# EAGLE design usb (EAGLE 5.11)
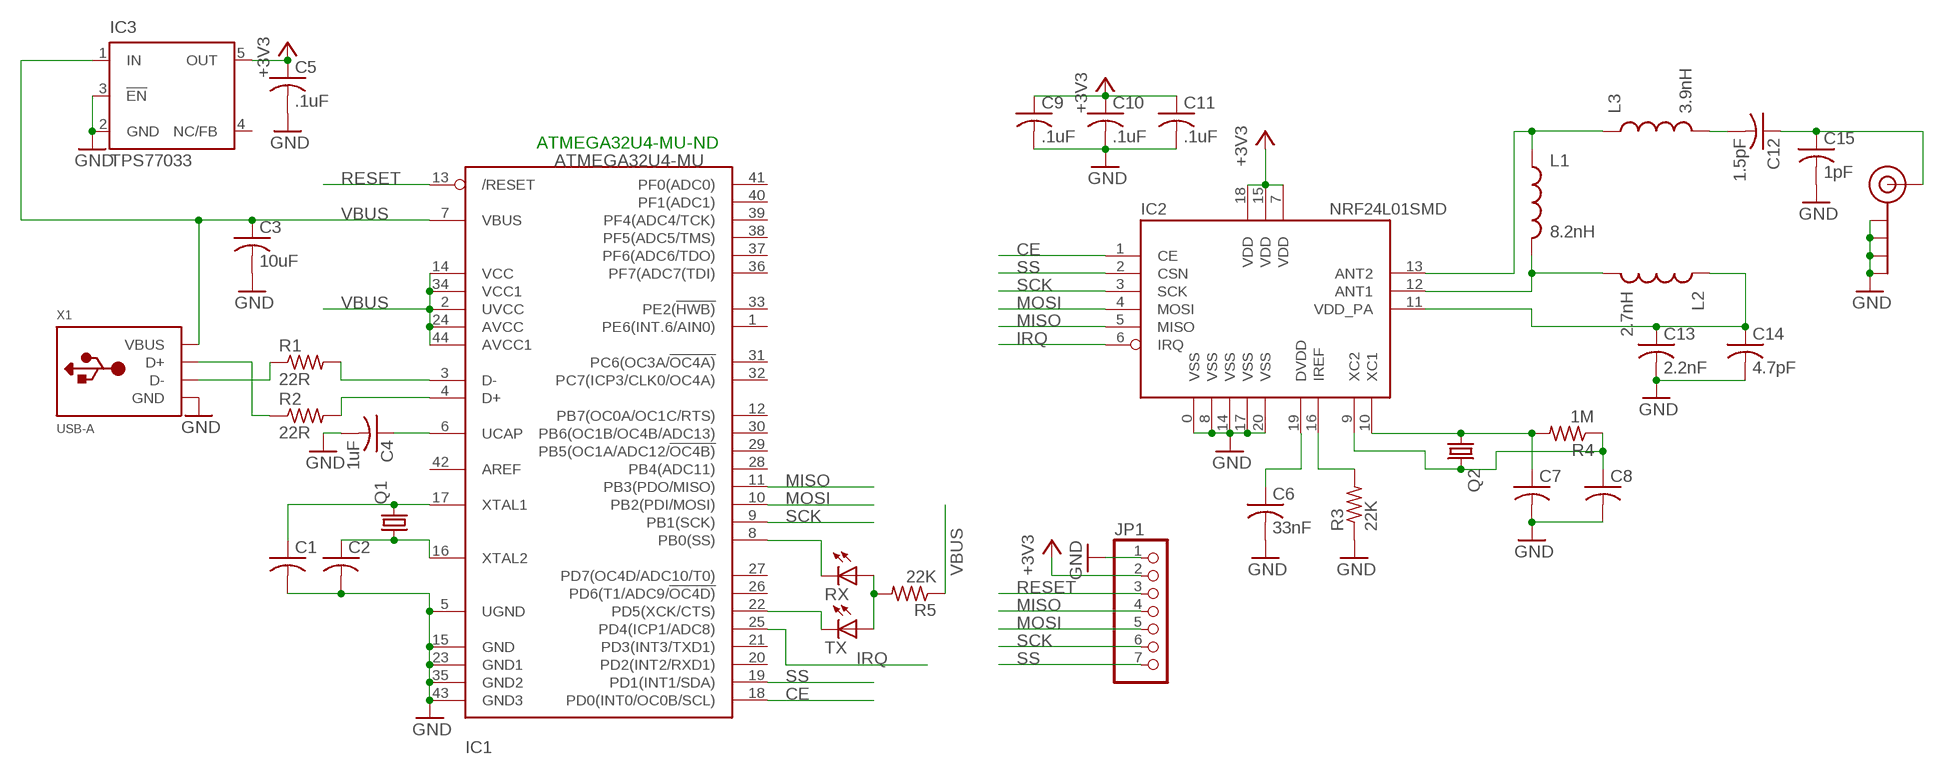
[diagram p0: schematic, sheet 1]

## Parts
C1  C-USC0603  [C0603]
C2  C-USC0603  [C0603]
C3  10uF  C-USC0805K  [C0805K]
C4  1uF  C-USC0603  [C0603]
C5  .1uF  C-USC0603  [C0603]
C6  33nF  C-USC0603  [C0603]
C7  C-USC0603  [C0603]
C8  C-USC0603  [C0603]
C9  .1uF  C-USC0603  [C0603]
C10  .1uF  C-USC0603  [C0603]
C11  .1uF  C-USC0603  [C0603]
C12  1.5pF  C-USC0603  [C0603]
C13  2.2nF  C-USC0603  [C0603]
C14  4.7pF  C-USC0603  [C0603]
C15  1pF  C-USC0603  [C0603]
IC1  ATMEGA32U4-MU  [QFN44]
IC2  NRF24L01SMD  [QFN20]
IC3  TPS77033  [SOT23-DBV]
J$1  SMA_EDGE  [SMA-EDGE]
JP1  PINHD-1X7  [1X07]
L1  8.2nH  INDUCTOR0402  [C0402]
L2  2.7nH  INDUCTOR0402  [C0402]
L3  3.9nH  INDUCTOR0402  [C0402]
Q1  CRYSTALHC49U-V  [HC49U-V]
Q2  CRYSTALHC49U-V  [HC49U-V]
R1  22R  R-US_R0603  [R0603]
R2  22R  R-US_R0603  [R0603]
R3  22K  R-US_R0603  [R0603]
R4  1M  R-US_R0603  [R0603]
R5  22K  R-US_R0603  [R0603]
RX  LEDCHIPLED_0805  [CHIPLED_0805]
TX  LEDCHIPLED_0805  [CHIPLED_0805]
X1  USB-A  [MOLEX_480371000]

## Nets
+3V3: C5.1 C9.1 C10.1 C11.1 IC2.7(VDD) IC2.15(VDD) IC2.18(VDD) IC3.5(OUT) JP1.2
CE: IC1.18(PD0(INT0/OC0B/SCL)) IC2.1(CE)
GND: C1.2 C2.2 C3.2 C4.2 C5.2 C6.2 C7.2 C8.2 C9.2 C10.2 C11.2 C13.2 C14.2 C15.2 IC1.5(UGND) IC1.15(GND) IC1.23(GND1) IC1.35(GND2) IC1.43(GND3) IC2.0(VSS) IC2.8(VSS) IC2.14(VSS) IC2.17(VSS) IC2.20(VSS) IC3.2(GND) IC3.3(!EN) J$1.GND@0(GND) J$1.GND@1(GND) J$1.GND@2(GND) J$1.GND@3(GND) JP1.1 R3.1 X1.4(GND)
IRQ: IC1.25(PD4(ICP1/ADC8)) IC2.6(IRQ)
MISO: IC1.11(PB3(PDO/MISO)) IC2.5(MISO) JP1.4
MOSI: IC1.10(PB2(PDI/MOSI)) IC2.4(MOSI) JP1.5
N$1: IC1.3(D-) R1.2
N$2: IC1.4(D+) R2.2
N$3: R1.1 X1.2(D-)
N$4: R2.1 X1.3(D+)
N$5: C1.1 IC1.17(XTAL1) Q1.2
N$6: C2.1 IC1.16(XTAL2) Q1.1
N$7: C4.1 IC1.6(UCAP)
N$8: IC1.8(PB0(SS)) RX.C
N$9: IC1.22(PD5(XCK/CTS)) TX.C
N$10: C6.1 IC2.19(DVDD)
N$11: IC2.16(IREF) R3.2
N$12: C7.1 IC2.10(XC1) Q2.1 R4.2
N$13: C8.1 IC2.9(XC2) Q2.2 R4.1
N$14: IC2.13(ANT2) L1.1 L3.1
N$15: IC2.12(ANT1) L1.2 L2.2
N$16: C12.2 L3.2
N$17: C12.1 C15.1 J$1.SIG(SIGNAL)
N$18: C13.1 C14.1 IC2.11(VDD_PA) L2.1
N$19: R5.2 RX.A TX.A
RESET: IC1.13(/RESET) JP1.3
SCK: IC1.9(PB1(SCK)) IC2.3(SCK) JP1.6
SS: IC1.19(PD1(INT1/SDA)) IC2.2(CSN) JP1.7
VBUS: C3.1 IC1.2(UVCC) IC1.7(VBUS) IC1.14(VCC) IC1.24(AVCC) IC1.34(VCC1) IC1.44(AVCC1) IC3.1(IN) R5.1 X1.1(VBUS)
Unconnected: IC1.1(PE6(INT.6/AIN0)) IC1.12(PB7(OC0A/OC1C/RTS)) IC1.20(PD2(INT2/RXD1)) IC1.21(PD3(INT3/TXD1)) IC1.26(PD6(T1/ADC9/!OC4D)) IC1.27(PD7(OC4D/ADC10/T0)) IC1.28(PB4(ADC11)) IC1.29(PB5(OC1A/ADC12/!OC4B)) IC1.30(PB6(OC1B/OC4B/ADC13)) IC1.31(PC6(OC3A/!OC4A)) IC1.32(PC7(ICP3/CLK0/OC4A)) IC1.33(PE2(!HWB)) IC1.36(PF7(ADC7(TDI)) IC1.37(PF6(ADC6/TDO)) IC1.38(PF5(ADC5/TMS)) IC1.39(PF4(ADC4/TCK)) IC1.40(PF1(ADC1)) IC1.41(PF0(ADC0)) IC1.42(AREF) IC3.4(NC/FB)

## Notes on the sheet
- ATMEGA32U4-MU-ND

## Library data of the parts
C1-C15 = adafruit:C-US: CAPACITOR, American symbol
IC1 = adafruit:ATMEGA32U4: http://www.ladyada.net/library/eagle
IC2 = SparkFun:NRF24L01: 2.4GHz Low Power Transceiver This is the very popular, low cost, very low power RF transceiver from Nordic Semiconductor. Simple SPI interface. SKU: COM-00690
IC3 = texas:TPS770*: ULTRALOW-POWER 50-mA LOW-DROPOUT LINEAR REGULATORS 50-mA Low-Dropout Regulator Source: http://focus.ti.com/lit/ds/symlink/tps77001.pdf; MF: TEXAS INSTRUMENTS; MPN: TPS77033DBVT; OC_FARNELL: 8461570; OC_NEWARK: 77C1187
J$1 = SparkFun:SMA_EDGE: SMA Antenna Connector End launch SMA connector. The paste layer has been removed so that the connector can be hand soldered onto the board after reflow.
JP1 = pinhead:PINHD-1X7: PIN HEADER
L1-L3 = SparkFun:INDUCTOR: Inductors Basic Inductor/Choke - 0603 and 1206. Footprints are not proven and vary greatly between part numbers.
Q1 Q2 = crystal:CRYSTAL: CRYSTAL; OC_FARNELL: 1666969; OC_NEWARK: unknown
R1-R5 = adafruit:R-US_: RESISTOR, American symbol
RX TX = adafruit:LED: LED OSRAM: - CHIPLED LG R971, LG N971, LY N971, LG Q971, LY Q971, LO R971, LY R971 LH N974, LH R974 LS Q976, LO Q976, LY Q976 LO Q996 - Hyper CHIPLED LW Q18S LB Q993, LB Q99A, LB R99A - SideLED LS A670, LO A670, LY A670, LG A670, LP A670 LB A673, LV A673, LT A673, LW A673 LH A674 LY A675 LS A676, LA A676, LO A676, LY A676, LW A676 LS A679, LY A679, LG A679 - Hyper Micro SIDELED® LS Y876, LA Y876, LO Y876, LY Y876 LT Y87S - SmartLED LW L88C, LW L88S LB L89C, LB L89S, LG L890 LS L89K, LO L89K, LY L89K LS L896, LA L896, LO L896, LY L896 - TOPLED LS T670, LO T670, LY T670, LG T670, LP T670 LSG T670, LSP T670, LSY T670, LOP T670, LYG T670 LG T671, LOG T671, LSG T671 LB T673, LV T673, LT T673, LW T673 LH T674 LS T676, LA T676, LO T676, LY T676, LB T676, LH T676, LSB T676, LW T676 LB T67C, LV T67C, LT T67C, LS T67K, LO T67K, LY T67K, LW E67C LS E67B, LA E67B, LO E67B, LY E67B, LB E67C, LV E67C, LT E67C LW T67C LS T679, LY T679, LG T679 LS T770, LO T770, LY T770, LG T770, LP T770 LB T773, LV T773, LT T773, LW T773 LH T774 LS E675, LA E675, LY E675, LS T675 LS T776, LA T776, LO T776, LY T776, LB T776 LHGB T686 LT T68C, LB T68C - Hyper Mini TOPLED® LB M676 - Mini TOPLED Santana® LG M470 LS M47K, LO M47K, LY M47K Source: http://www.osram.convergy.de/
X1 = adafruit:USB-A: USB type A 'plug' Used for things that can directly connect to a USB port, say USB key

## Board
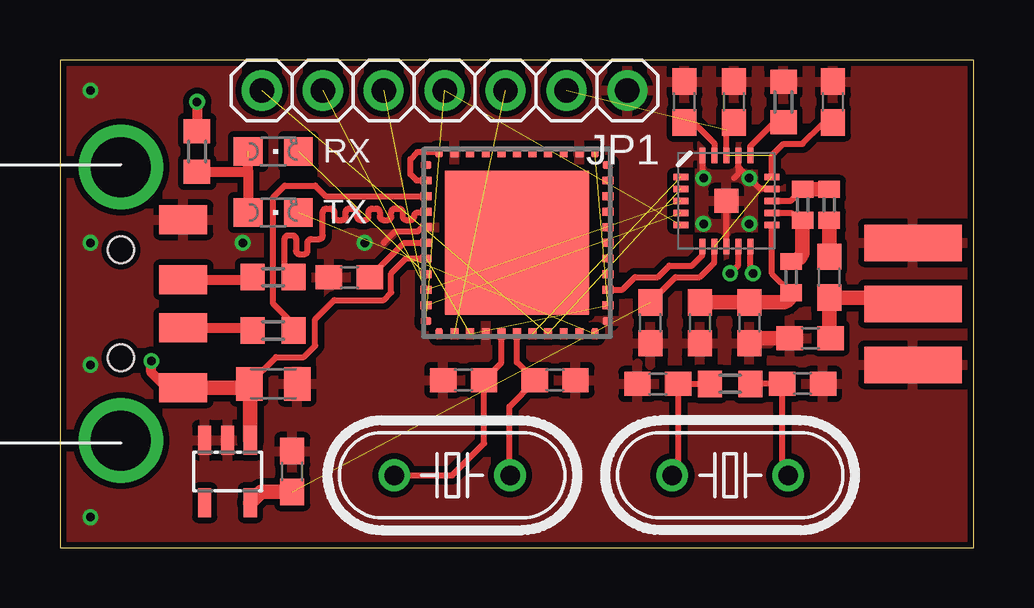
[diagram p1: board, top side]
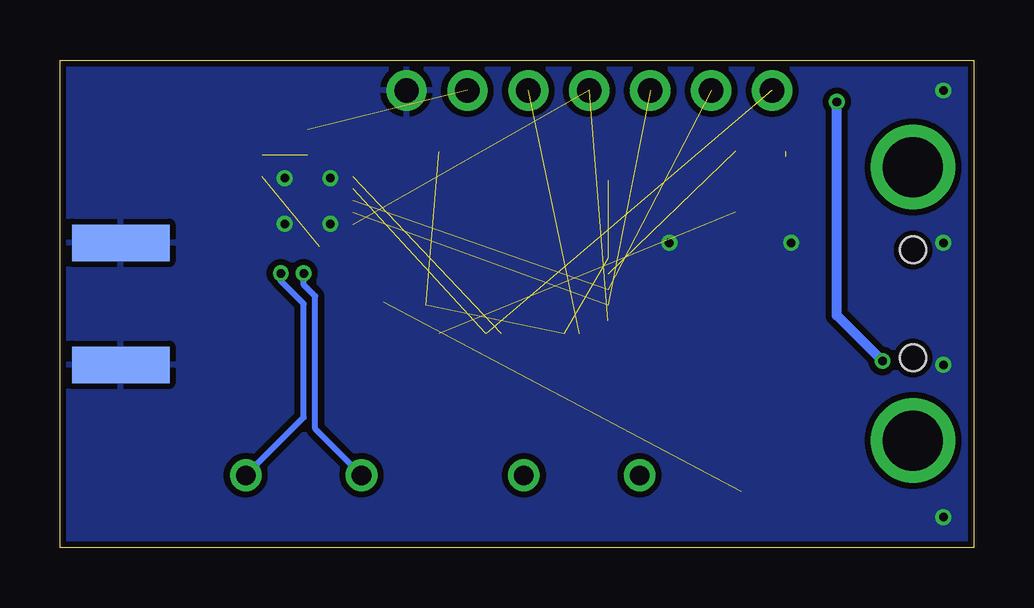
[diagram p2: board, bottom side, seen from below]

Size 38.1 x 20.32 mm. Coordinates in mm from the lower left corner, seen from the top.
Outline: 0,0 38.1,0 38.1,20.32 0,20.32 0,0
Copper layers (1*16): Top 0.035mm / dielectric 1.5mm / Bottom 0.035mm
Design rules "ITead_rule": minimum track width 8mil, minimum drill 12mil, track to track 8mil, track to pad 8mil, pad to pad 8mil, via to via 8mil, smd to smd 8mil, copper to edge 10mil, drill to drill 10mil, minimum pad ring 10mil, minimum via ring 6mil, stop-mask expansion 2mil, vias tented up to drill 100mil, thermal gap 10mil

### Footprints (pad centres in the part's own frame; a part is rotated, then mirrored left to right if it is on the bottom)
C0603 = smd 1.1 x 1: 1 -0.85,0; 2 0.85,0
C0805K = smd 1.1 x 1.4: 1 -1,0; 2 1,0
QFN44 = smd 0.45 x 0.33: 1 -3.788,3.25; 2 -3.788,2.6; 3 -3.788,1.95; 4 -3.788,1.3; 5 -3.788,0.65; 6 -3.788,0; 7 -3.788,-0.65; 8 -3.788,-1.3; 9 -3.788,-1.95; 10 -3.788,-2.6; 11 -3.788,-3.25; 23 3.788,-3.25; 24 3.788,-2.6; 25 3.788,-1.95; 26 3.788,-1.3; 27 3.788,-0.65; 28 3.788,0; 29 3.788,0.65; 30 3.788,1.3; 31 3.788,1.95; 32 3.788,2.6; 33 3.788,3.25 | smd 0.33 x 0.45: 12 -3.25,-3.788; 13 -2.6,-3.788; 14 -1.95,-3.788; 15 -1.3,-3.788; 16 -0.65,-3.788; 17 0,-3.788; 18 0.65,-3.788; 19 1.3,-3.788; 20 1.95,-3.788; 21 2.6,-3.788; 22 3.25,-3.788; 34 3.25,3.788; 35 2.6,3.788; 36 1.95,3.788; 37 1.3,3.788; 38 0.65,3.788; 39 0,3.788; 40 -0.65,3.788; 41 -1.3,3.788; 42 -1.95,3.788; 43 -2.6,3.788; 44 -3.25,3.788 | smd 6 x 6: EXP 0,0
QFN20 = smd 1 x 1: 0 0,0 | smd 0.637 x 0.254: 1 -1.9,1; 2 -1.9,0.5; 3 -1.9,0; 4 -1.9,-0.5; 5 -1.9,-1; 11 1.9,-1; 12 1.9,-0.5; 13 1.9,0; 14 1.9,0.5; 15 1.9,1 | smd 0.254 x 0.637: 6 -1,-1.9; 7 -0.5,-1.9; 8 0,-1.9; 9 0.5,-1.9; 10 1,-1.9; 16 1,1.9; 17 0.5,1.9; 18 0,1.9; 19 -0.5,1.9; 20 -1,1.9
SOT23-DBV = smd 0.55 x 1.2: 1 -0.95,-1.3; 2 0,-1.3; 3 0.95,-1.3; 4 0.95,1.3; 5 -0.95,1.3
SMA-EDGE = smd 1.524 x 4.064: GND@0 0,0; GND@1 5.08,0; SIG 2.54,0 | smd 1.524 x 4.064 bottom: GND@2 0,0; GND@3 5.08,0
1X07 = drill 1.016 pad 1.676 round: 1 -7.62,0; 2 -5.08,0; 3 -2.54,0; 4 0,0; 5 2.54,0; 6 5.08,0; 7 7.62,0
C0402 = smd 0.7 x 0.9: 1 -0.65,0; 2 0.65,0
HC49U-V = drill 0.813 round: 1 -2.413,0; 2 2.413,0
R0603 = smd 1 x 1.1: 1 -0.85,0; 2 0.85,0
CHIPLED_0805 = smd 1.2 x 1.2: A 0,-1.05; C 0,1.05
MOLEX_480371000 = smd 1.2 x 2: 1 3.5,2.6; 2 1,2.6; 3 -1,2.6; 4 -3.5,2.6 | drill 2.5 round: M1 -5.7,0; M2 5.7,0 | hole 1.1: -2.25,0; 2.25,0

### Placement (x,y rotation side)
C1  20.64,6.99 0 top
C2  16.83,6.99 180 top
C3  8.89,6.83 0 top
C4  12.06,11.27 180 top
C5  9.68,3.17 90 top
C6  26.04,18.57 90 top
C7  30.96,6.83 0 top
C8  24.92,6.83 180 top
C9  24.61,9.37 270 top
C10  32.23,18.57 90 top
C11  28.1,18.57 90 top
C12  32.07,11.27 90 top
C13  28.73,9.37 270 top
C14  26.67,9.37 270 top
C15  31.27,8.73 180 top
IC1  19.05,12.7 0 top
IC2  27.78,14.45 0 top
IC3  6.99,3.17 180 top
J$1  35.56,7.62 90 top
JP1  16.03,19.05 180 top
L1  30.96,14.29 270 top
L2  30.48,11.27 90 top
L3  32.07,14.29 270 top
Q1  16.35,3.02 0 top
Q2  27.94,3.02 180 top
R1  8.89,9.05 0 top
R2  8.89,11.27 0 top
R3  30.16,18.57 270 top
R4  27.94,6.83 0 top
R5  5.71,16.51 270 top
RX  8.89,16.51 270 top
TX  8.89,13.97 270 top
X1  2.54,10.16 270 top

### Tracks (layer width: path | path; a pad name or v marks a point on that pad's centre or on a via)
+3V3  (4 unrouted)
  Top 0.254: IC2.18 27.78,17.41 C11.1 | IC2.15 29.68,16.35 30.16,16.83 30.96,16.83 31.75,17.62 32.12,17.62 C10.1 | IC2.7 27.28,11.88 26.67,11.27 25.66,11.27 C9.1
  Top 0.61: C5.1 8.38,2.33 IC3.5
CE  (1 unrouted)
GND  (via drill 0.36)
  Top 0.254: IC1.5 15.1,13.35 14.92,13.18 13.97,13.18 13.49,12.7 | IC2.8 IC2.0 | IC2.14 29.19,14.95 28.28,15.85 | 28.28,15.85 IC2.17 | IC2.20 26.78,15.35 26.67,15.24 | 28.28,15.85 28.28,15.58 28.1,15.4
  Top 0.61: C15.2 28.95,8.73 C13.2
  other vias: 7.62,12.7 1.27,12.7 1.27,7.62 1.27,1.27 1.27,19.05 12.7,12.7 26.83,13.49 28.73,13.49 28.73,15.4 26.83,15.4
  pour Top (isolate 0.254): 0,0 38.1,0 38.1,20.32 0,20.32
  pour Bottom (isolate 0.254): 0,0 38.1,0 38.1,20.32 0,20.32
IRQ
  Top 0.254: IC1.25 23.45,10.75 23.97,11.27 24.92,11.27 25.4,11.75 26.35,11.75 26.78,12.18 IC2.6
MISO  (2 unrouted)
MOSI  (2 unrouted)
N$1
  Top 0.254: R1.2 9.74,9.31 8.89,10.16 8.89,14.61 9.37,15.08 10.64,15.08 11.07,14.65 IC1.3
N$2
  Top 0.254: R2.2 arc-90 9.37,11.64 9.37,12.86 arc-90 9.53,13.02 9.68,13.02 arc-90 9.84,12.86 9.84,12.38 arc90 10,12.22 10.16,12.22 arc90 10.32,12.38 10.32,12.7 arc-90 10.48,12.86 10.79,12.86 arc90 10.95,13.02 10.95,13.97 arc-90 11.11,14.13 11.27,14.13 arc-90 11.43,13.97 11.43,13.81 arc90 11.59,13.65 11.75,13.65 arc90 11.91,13.81 11.91,13.97 arc-90 12.06,14.13 12.22,14.13 arc-90 12.38,13.97 12.38,13.81 arc90 12.54,13.65 12.7,13.65 arc90 12.86,13.81 12.86,13.97 arc-90 13.02,14.13 13.18,14.13 arc-90 13.34,13.97 13.34,13.81 arc90 13.49,13.65 13.65,13.65 arc90 13.81,13.81 13.81,13.97 arc-90 13.97,14.13 14.13,14.13 arc-90 14.29,13.97 14.29,13.81 arc90 14.45,13.65 14.61,13.65 arc90 14.76,13.81 arc-90 14.92,13.97 15.23,13.97 arc90 IC1.4
N$3
  Top 0.406: X1.2 7.93,9.16 R1.1
N$4
  Top 0.406: X1.3 7.93,11.16 R2.1
N$5
  Top 0.254: IC1.17 19.05,7.72 C1.1 19.79,6.93 18.73,5.87 18.73,3.05 Q1.2
N$6
  Top 0.254: IC1.16 18.4,7.71 C2.1 17.68,4.34 16.35,3.02 Q1.1 | Q1.1
N$7
  Top 0.254: IC1.6 14.34,12.7 C4.1
N$8  (1 unrouted)
N$9  (1 unrouted)
N$10
  Top 0.254: IC2.19 27.28,16.85 26.51,17.62 26.14,17.62 C6.1
N$11
  Top 0.254: IC2.16 28.78,16.72 29.69,17.62 30.06,17.62 R3.2
N$12  (via drill 0.36)
  Top 0.254: C7.1 30.11,3.26 Q2.1 | C7.1 R4.2 | C7.1 | IC2.10 28.78,11.54 v28.89,11.43
  Bottom 0.254: v28.89,11.43 28.89,11.11 27.94,10.16 27.94,5.43 Q2.1
N$13  (via drill 0.36)
  Top 0.254: Q2.2 25.77,3.26 C8.1 R4.1 | R4.1 | IC2.9 28.28,11.77 v27.94,11.43
  Bottom 0.254: v27.94,11.43 27.94,10.95 27.46,10.48 27.46,4.95 Q2.2
N$14
  Top 0.254: IC2.13 30.46,14.45 L1.1
  Top 0.61: L1.1 L3.1
N$15
  Top 0.254: IC2.12 30.5,13.95 30.96,13.49 L1.2
  Top 0.61: 30.96,13.49 30.96,12.4 arc-90 L2.2
N$16
  Top 0.61: C12.2 L3.2 | C12.2
N$17
  Top 0.61: J$1.SIG 35.3,10.42 C12.1 32.07,8.79 C15.1
N$18
  Top 0.254: IC2.11 29.68,11.42 L2.1
  Top 0.61: C14.1 C13.1 30.07,10.22 arc90 L2.1
N$19  (1 unrouted)
  Top 0.406: 7.84,15.72 TX.A | 7.84,15.72 7.84,16.29 7.62,16.51 | R5.2 7.78,15.66 7.84,15.72
RESET  (1 unrouted)
SCK  (2 unrouted)
SS  (2 unrouted)
VBUS  (via drill 0.36)  (4 unrouted)
  Top 0.254: IC1.7 14.43,12.05 13.81,11.43 13.81,10.64 13.49,10.32 11.43,10.32 10.64,9.53 10.64,8.41 10.16,7.94 9,7.94 C3.1 | IC1.2 14.86,15.3 14.61,15.56 14.61,16.19 14.9,16.49 IC1.44
  Top 0.406: X1.1 4.61,6.66 4.45,6.83 4.29,6.83 3.81,7.3 v3.81,7.78 | v5.71,18.57 R5.1
  Top 0.61: X1.1 7.72,6.66 | 7.72,6.66 C3.1 | IC3.1 7.93,6.45 7.72,6.66
  Bottom 0.406: v5.71,18.57 5.71,9.68 v3.81,7.78